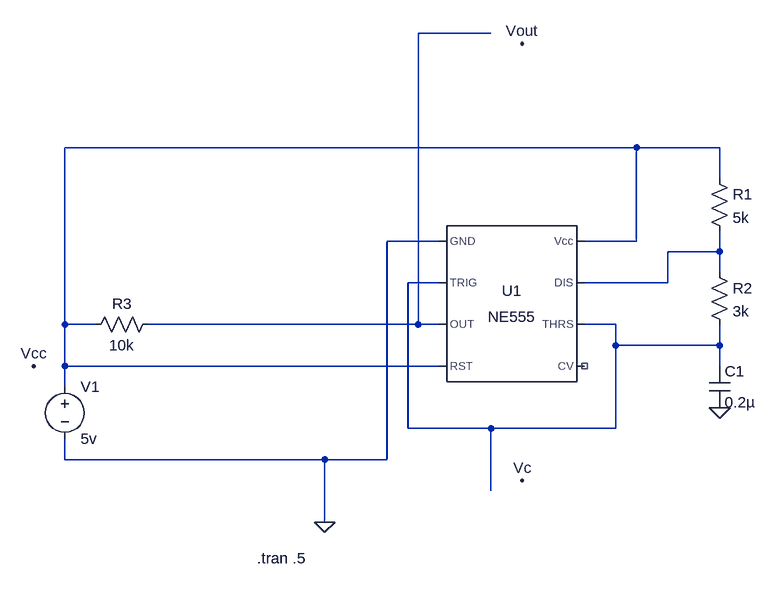
[diagram p0: schematic Q3_Astable.asc]
Q3_Astable.asc, the LTspice schematic file:
Version 4.1
SHEET 1 880 680
WIRE 384 -592 272 -592
WIRE 608 -416 -272 -416
WIRE 736 -416 608 -416
WIRE 736 -368 736 -416
WIRE 304 -272 224 -272
WIRE 608 -272 608 -416
WIRE 608 -272 528 -272
WIRE 736 -256 736 -288
WIRE 736 -256 656 -256
WIRE 736 -224 736 -256
WIRE 304 -208 256 -208
WIRE 656 -208 656 -256
WIRE 656 -208 528 -208
WIRE -272 -144 -272 -416
WIRE -224 -144 -272 -144
WIRE 272 -144 272 -592
WIRE 272 -144 -144 -144
WIRE 304 -144 272 -144
WIRE 576 -144 528 -144
WIRE 576 -112 576 -144
WIRE 736 -112 736 -144
WIRE 736 -112 576 -112
WIRE -272 -80 -272 -144
WIRE 304 -80 -272 -80
WIRE 736 -80 736 -112
WIRE -272 -48 -272 -80
WIRE 256 16 256 -208
WIRE 384 16 256 16
WIRE 576 16 576 -112
WIRE 576 16 384 16
WIRE -272 64 -272 32
WIRE 128 64 -272 64
WIRE 224 64 224 -272
WIRE 224 64 128 64
WIRE 384 112 384 16
WIRE 128 160 128 64
FLAG 736 -16 0
FLAG 128 160 0
FLAG -320 -80 Vcc
FLAG 432 96 Vc
FLAG 432 -576 Vout
SYMBOL Misc\\NE555 416 -176 R0
SYMATTR InstName U1
SYMBOL res 720 -384 R0
SYMATTR InstName R1
SYMATTR Value 5k
SYMBOL res 720 -240 R0
SYMATTR InstName R2
SYMATTR Value 3k
SYMBOL cap 720 -80 R0
SYMATTR InstName C1
SYMATTR Value 0.2µ
SYMBOL voltage -272 -64 R0
WINDOW 123 0 0 Left 0
WINDOW 39 0 0 Left 0
SYMATTR InstName V1
SYMATTR Value 5v
SYMBOL res -128 -160 R90
WINDOW 0 0 56 VBottom 2
WINDOW 3 32 56 VTop 2
SYMATTR InstName R3
SYMATTR Value 10k
TEXT 24 216 Left 2 !.tran .5

The netlist it stands for:
* Q3_Astable.asc
X§U1 0 N004 N001 N002 NC_01 N004 N003 N002 NE555  ; pins GND TRIG OUT RST CV THRS DIS Vcc
R1 N002 N003 5k
R2 N003 N004 3k
C1 N004 0 0.2µ
V1 N002 0 5v
R3 N001 N002 10k
.tran .5
.lib NE555.sub
.backanno
.end